# Altium schematic sheet Flyback_CCM_150_24V_100KHz_V1.0.SchDoc
size A4; SheetNumber: 1; SheetTotal: 1
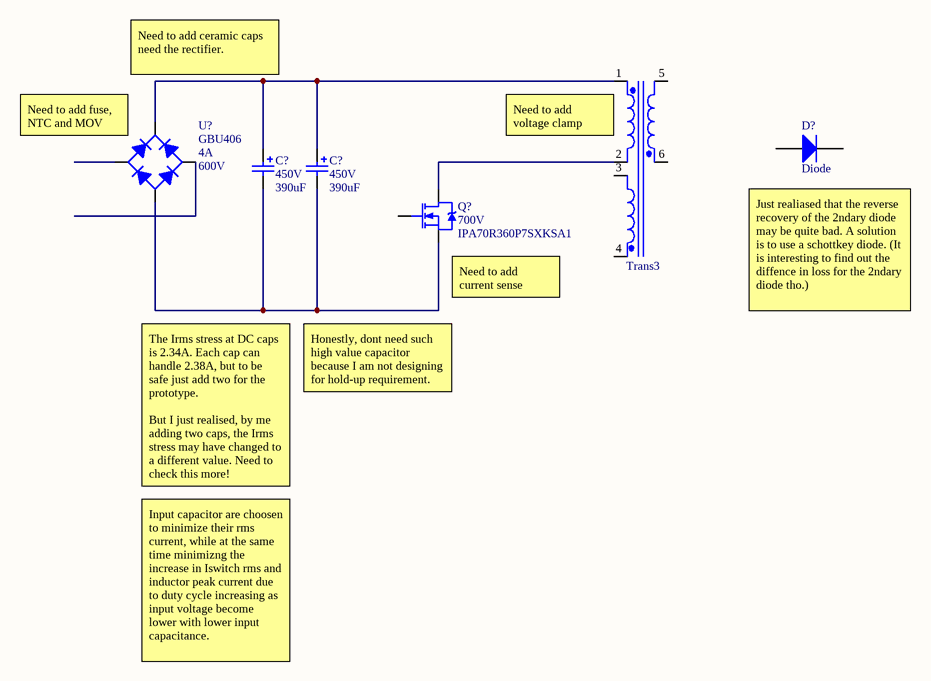
[diagram p0: Flyback_CCM_150_24V_100KHz_V1.0.SchDoc]

## Parts
(Parts that share a designator on the sheet are numbered #1, #2 ... from top to bottom, then left to right.)
?  Trans3  [ETD44]
C?#1  value 390uF  Voltage_Max: 450V  [CAP_TH_Radial_10mmP_40mmH]  (hidden comment: CAP_390U_450V_20%_TH-Radial-10mm)
C?#2  value 390uF  Voltage_Max: 450V  [CAP_TH_Radial_10mmP_40mmH]  (hidden comment: CAP_390U_450V_20%_TH-Radial-10mm)
D?  Diode  [SMC]
Q?  Vds_Max: 700V  Part_Number: IPA70R360P7SXKSA1  [T0-220-3]  (hidden comment: NMOS_700V_IPA70R360P7SXKSA1)
U?  Part_Number: GBU406  I_MAX: 4A  V_Max: 600V  [4_SIP]  (hidden comment: DiodeBrige_600V_4A_TH-4-SIP-5.3mm)

## Nets
Net?_1: ?.1(Pri_1) C?#1.1 C?#2.1 U?.2(AC)
Net?_2: ?.2(Pri_2) Q?.2(D)
NetC?#1_2: C?#1.2 C?#2.2 Q?.3(S) U?.3(AC)

Not connected (* = marked no-connect by the designer): ? 3(Pri_3) 4(Pri_4) 5(Sec_5) 6(Sec_6); D? 1(A) 2(K); Q? 1(G); U? 1(+) 4(-)

## Notes on the sheet
- Need to add ceramic caps need the rectifier.
- (near U?) Need to add fuse, NTC and MOV
- Need to add voltage clamp
- (near Q?) Need to add current sense Resistor
- (near D?) Just realiased that the reverse recovery of the 2ndary diode may be quite bad. A solution is to use a schottkey diode. (It is interesting to find out the diffence in loss for the 2ndary diode tho.)
- Honestly, dont need such high value capacitor because I am not designing for hold-up requirement.
- The Irms stress at DC caps is 2.34A. Each cap can handle 2.38A, but to be safe just add two for the prototype.
  But I just realised, by me adding two caps, the Irms stress may have changed to a different value. Need to check this more!
- Input capacitor are choosen to minimize their rms current, while at the same time minimizng the increase in Iswitch rms and inductor peak current due to duty cycle increasing as input voltage become lower with lower input capacitance.

## Library data of the parts
? = Transformer_ETD44: Flyback converter transformer ETD44, 2 output winding, 1 input winding.
C?#1 C?#2 = CAP_390U_450V_20%_TH-Radial-10mm: Polarized Capacitor (Radial) 390UF, 450V, 20% TH Radial 10m Pitch; Part_Number: LLS2W391MELC; Irms_Max: 2.38A @ 120Hz; JLC#: ?
D? = Diode: Default Diode; Published: 8-Jun-2000; LatestRevisionDate: 17-Jul-2002; LatestRevisionNote: Re-released for DXP Platform.; PackageVersion: Sep-1996; PackageReference: SMC; Publisher: Altium Limited; PackageDescription: DO-214-AB/SMC; 2 C-Bend Leads; Body 7.9 x 5.9 mm, inc. leads (LxW); Code_JEDEC: DO-214-AB
Q? = NMOS_700V_IPA70R360P7SXKSA1: N-Channel Power MOSFET, 700Vds, T0-220-3; Rds(on)_Max: 0.36R; RthJC: 4.7K/W; Tj_Max: 150deg; ComponentLink1Description: Manufacturer Link; ComponentLink1URL: http://www.irf.com/; JLC#: ?
U? = DiodeBrige_600V_4A_TH-4-SIP-5.3mm: Full Wave Diode Bridge, 600V, 4A.; Package: 4-SIP (5.3mm picth); JLC#: ?